# EAGLE design cirquit (EAGLE 8.4.1)
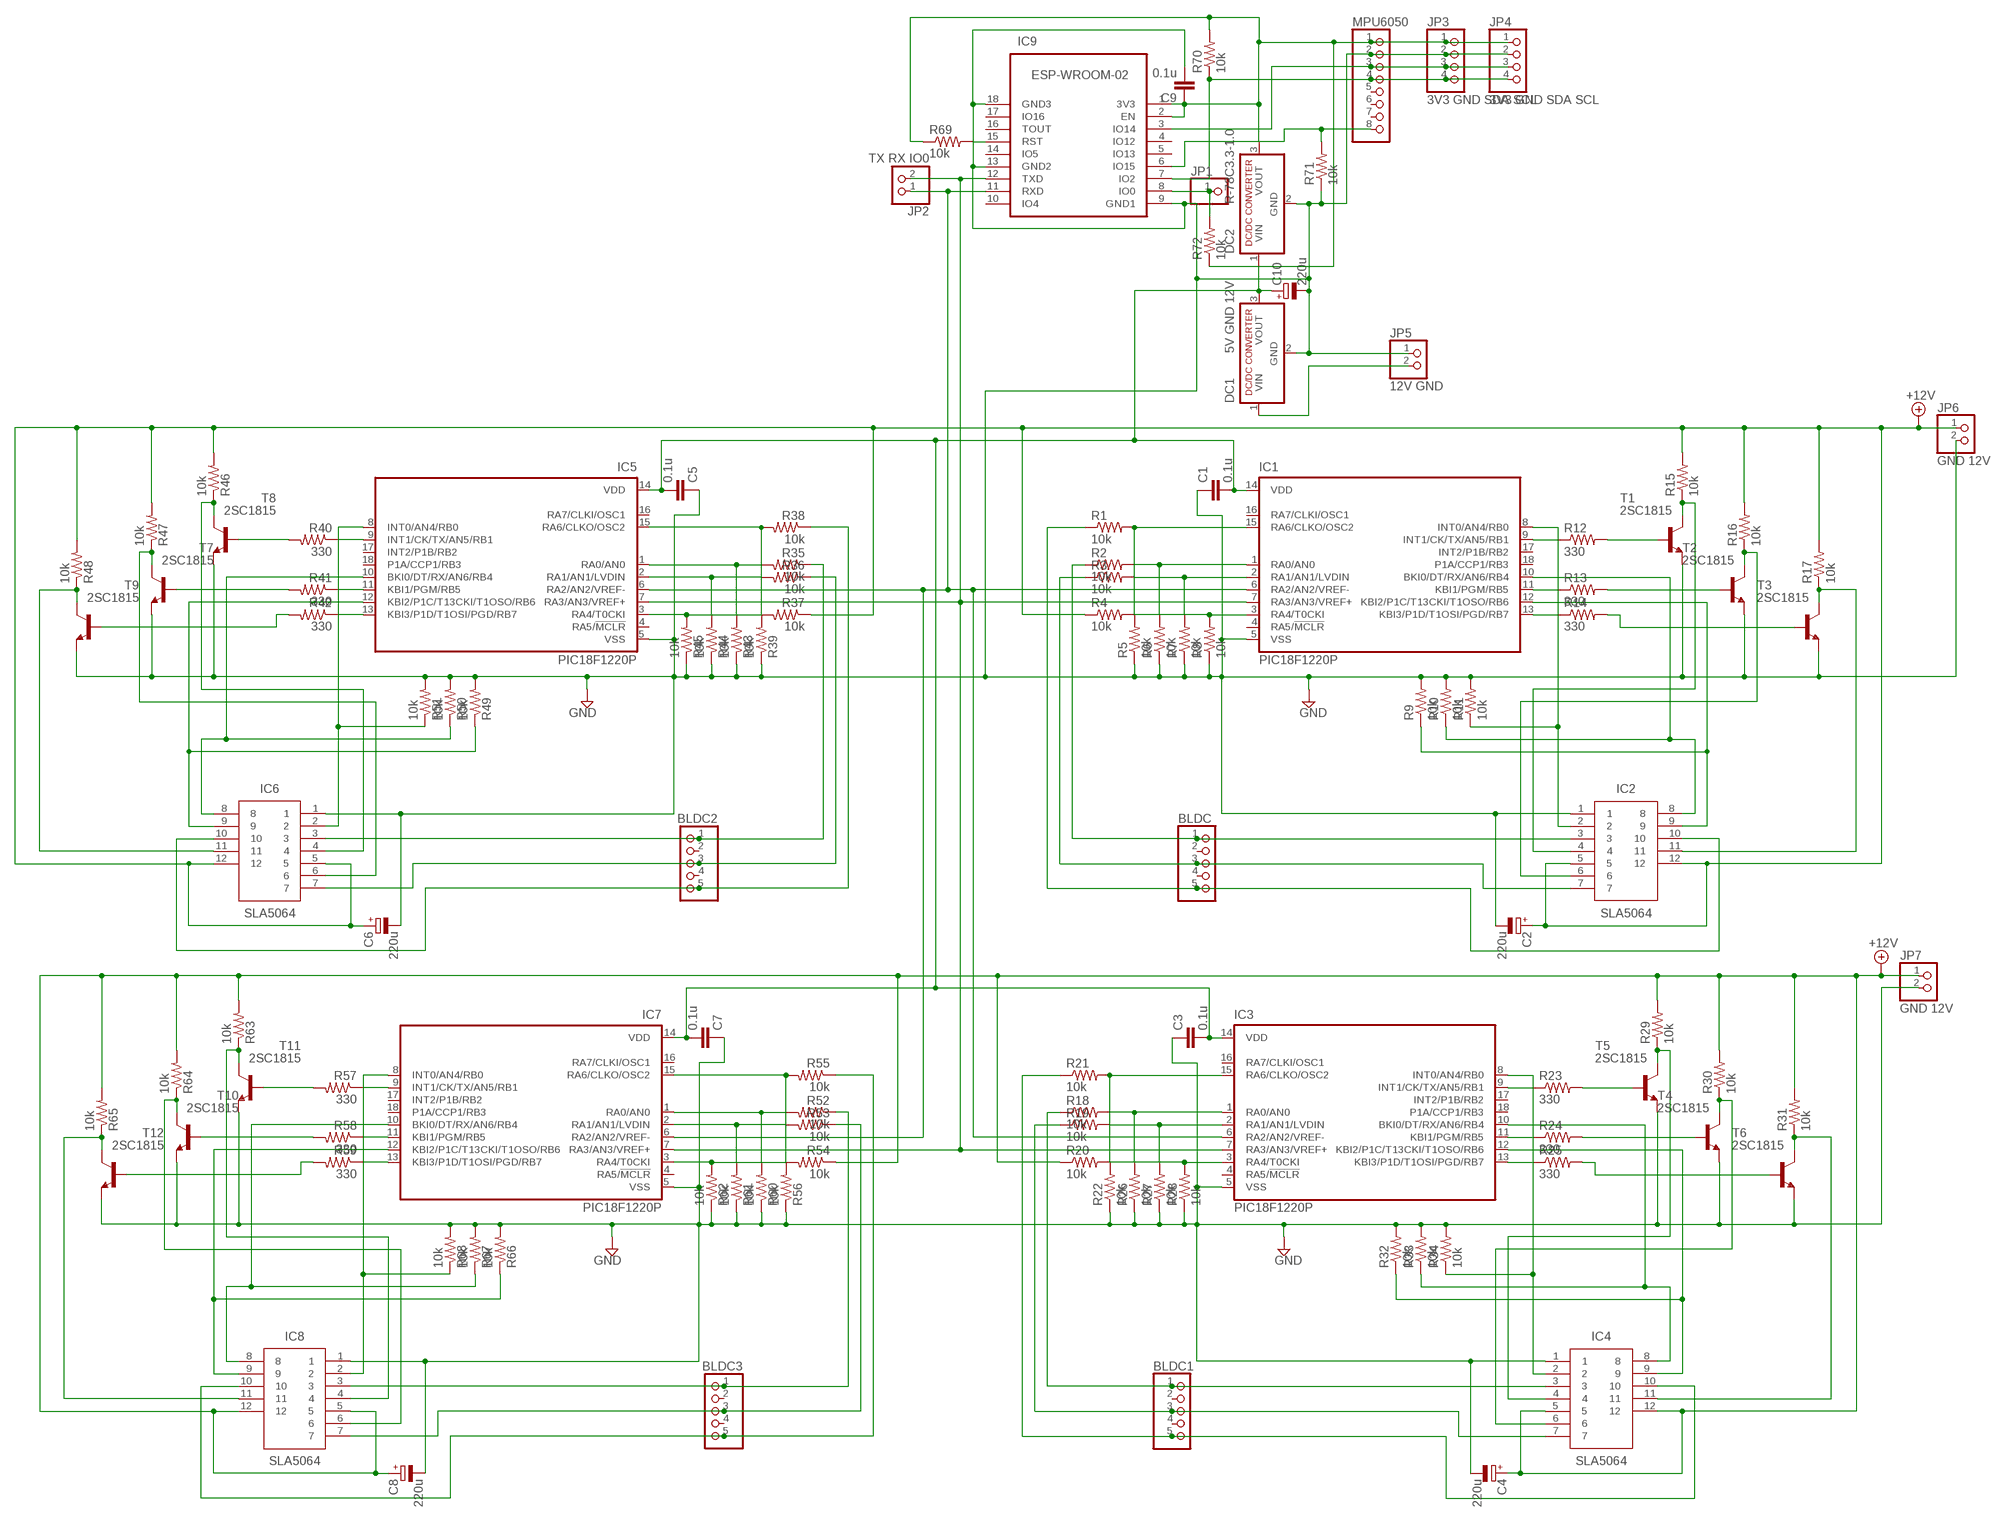
[diagram p0: schematic, sheet 1]

## Parts
BLDC  PINHD-1X5  [1X05]
BLDC1  PINHD-1X5  [1X05]
BLDC2  PINHD-1X5  [1X05]
BLDC3  PINHD-1X5  [1X05]
C1  0.1u  C2.5/2  [C2.5-2]
C2  220u  CPOL-EUE2,5-6E  [E2,5-6E]
C3  0.1u  C2.5/2  [C2.5-2]
C4  220u  CPOL-EUE2,5-6E  [E2,5-6E]
C5  0.1u  C2.5/2  [C2.5-2]
C6  220u  CPOL-EUE2,5-6E  [E2,5-6E]
C7  0.1u  C2.5/2  [C2.5-2]
C8  220u  CPOL-EUE2,5-6E  [E2,5-6E]
C9  0.1u  C2.5/2  [C2.5-2]
C10  220u  CPOL-EUE2,5-6E  [E2,5-6E]
DC1  5V GND 12V  R-78C5.0-1.0  [SIP3]
DC2  R-78C3.3-1.0  [SIP3]
IC1  PIC18F1220P  [DIL18]
IC2  SLA5064  [TO254P500X3150X1890-12P]
IC3  PIC18F1220P  [DIL18]
IC4  SLA5064  [TO254P500X3150X1890-12P]
IC5  PIC18F1220P  [DIL18]
IC6  SLA5064  [TO254P500X3150X1890-12P]
IC7  PIC18F1220P  [DIL18]
IC8  SLA5064  [TO254P500X3150X1890-12P]
IC9  ESP-WROOM-02  ESP-WROOM-02FRONT-FACE  [FRONT-FACE]
JP1  PINHD-1X1  [1X01]
JP2  TX RX IO0  PINHD-1X2  [1X02]
JP3  3V3 GND SDA SCL  PINHD-1X4  [1X04]
JP4  3V3 GND SDA SCL  PINHD-1X4  [1X04]
JP5  12V GND  PINHD-1X2  [1X02]
JP6  GND 12V  PINHD-1X2  [1X02]
JP7  GND 12V  PINHD-1X2  [1X02]
MPU6050  PINHD-1X8  [1X08]
R1  10k  R-US_0204/7  [0204/7]
R2  10k  R-US_0204/7  [0204/7]
R3  10k  R-US_0204/7  [0204/7]
R4  10k  R-US_0204/7  [0204/7]
R5  10k  R-US_0204/7  [0204/7]
R6  10k  R-US_0204/7  [0204/7]
R7  10k  R-US_0204/7  [0204/7]
R8  10k  R-US_0204/7  [0204/7]
R9  10k  R-US_0204/7  [0204/7]
R10  10k  R-US_0204/7  [0204/7]
R11  10k  R-US_0204/7  [0204/7]
R12  330  R-US_0204/7  [0204/7]
R13  330  R-US_0204/7  [0204/7]
R14  330  R-US_0204/7  [0204/7]
R15  10k  R-US_0204/7  [0204/7]
R16  10k  R-US_0204/7  [0204/7]
R17  10k  R-US_0204/7  [0204/7]
R18  10k  R-US_0204/7  [0204/7]
R19  10k  R-US_0204/7  [0204/7]
R20  10k  R-US_0204/7  [0204/7]
R21  10k  R-US_0204/7  [0204/7]
R22  10k  R-US_0204/7  [0204/7]
R23  330  R-US_0204/7  [0204/7]
R24  330  R-US_0204/7  [0204/7]
R25  330  R-US_0204/7  [0204/7]
R26  10k  R-US_0204/7  [0204/7]
R27  10k  R-US_0204/7  [0204/7]
R28  10k  R-US_0204/7  [0204/7]
R29  10k  R-US_0204/7  [0204/7]
R30  10k  R-US_0204/7  [0204/7]
R31  10k  R-US_0204/7  [0204/7]
R32  10k  R-US_0204/7  [0204/7]
R33  10k  R-US_0204/7  [0204/7]
R34  10k  R-US_0204/7  [0204/7]
R35  10k  R-US_0204/7  [0204/7]
R36  10k  R-US_0204/7  [0204/7]
R37  10k  R-US_0204/7  [0204/7]
R38  10k  R-US_0204/7  [0204/7]
R39  10k  R-US_0204/7  [0204/7]
R40  330  R-US_0204/7  [0204/7]
R41  330  R-US_0204/7  [0204/7]
R42  330  R-US_0204/7  [0204/7]
R43  10k  R-US_0204/7  [0204/7]
R44  10k  R-US_0204/7  [0204/7]
R45  10k  R-US_0204/7  [0204/7]
R46  10k  R-US_0204/7  [0204/7]
R47  10k  R-US_0204/7  [0204/7]
R48  10k  R-US_0204/7  [0204/7]
R49  10k  R-US_0204/7  [0204/7]
R50  10k  R-US_0204/7  [0204/7]
R51  10k  R-US_0204/7  [0204/7]
R52  10k  R-US_0204/7  [0204/7]
R53  10k  R-US_0204/7  [0204/7]
R54  10k  R-US_0204/7  [0204/7]
R55  10k  R-US_0204/7  [0204/7]
R56  10k  R-US_0204/7  [0204/7]
R57  330  R-US_0204/7  [0204/7]
R58  330  R-US_0204/7  [0204/7]
R59  330  R-US_0204/7  [0204/7]
R60  10k  R-US_0204/7  [0204/7]
R61  10k  R-US_0204/7  [0204/7]
R62  10k  R-US_0204/7  [0204/7]
R63  10k  R-US_0204/7  [0204/7]
R64  10k  R-US_0204/7  [0204/7]
R65  10k  R-US_0204/7  [0204/7]
R66  10k  R-US_0204/7  [0204/7]
R67  10k  R-US_0204/7  [0204/7]
R68  10k  R-US_0204/7  [0204/7]
R69  10k  R-US_0204/7  [0204/7]
R70  10k  R-US_0204/7  [0204/7]
R71  10k  R-US_0204/7  [0204/7]
R72  10k  R-US_0204/7  [0204/7]
T1  2SC1815  [TO92-ECB]
T2  2SC1815  [TO92-ECB]
T3  2SC1815  [TO92-ECB]
T4  2SC1815  [TO92-ECB]
T5  2SC1815  [TO92-ECB]
T6  2SC1815  [TO92-ECB]
T7  2SC1815  [TO92-ECB]
T8  2SC1815  [TO92-ECB]
T9  2SC1815  [TO92-ECB]
T10  2SC1815  [TO92-ECB]
T11  2SC1815  [TO92-ECB]
T12  2SC1815  [TO92-ECB]

## Nets
+12V [power]: C2.+ C4.+ C6.+ C8.+ IC2.5 IC2.12 IC4.5 IC4.12 IC6.5 IC6.12 IC8.5 IC8.12 JP6.1 JP7.1 R4.1 R15.2 R16.2 R17.2 R20.1 R29.2 R30.2 R31.2 R37.1 R46.2 R47.2 R48.2 R54.1 R63.2 R64.2 R65.2
GND [GND]: C1.1 C2.- C3.1 C4.- C5.1 C6.- C7.1 C8.- C9.2 C10.- DC1.2(GND) DC2.2(GND) IC1.5(VSS) IC2.1 IC3.5(VSS) IC4.1 IC5.5(VSS) IC6.1 IC7.5(VSS) IC8.1 IC9.9(GND1) IC9.13(GND2) IC9.18(GND3) JP3.2 JP4.2 JP5.1 JP6.2 JP7.2 MPU6050.2 R5.1 R6.1 R7.1 R8.1 R9.2 R10.2 R11.2 R22.1 R26.1 R27.1 R28.1 R32.2 R33.2 R34.2 R39.1 R43.1 R44.1 R45.1 R49.2 R50.2 R51.2 R56.1 R60.1 R61.1 R62.1 R66.2 R67.2 R68.2 R71.1 T1.E T2.E T3.E T4.E T5.E T6.E T7.E T8.E T9.E T10.E T11.E T12.E
N$1: IC1.15(RA6/CLKO/OSC2) R1.2 R5.2
N$2: IC1.1(RA0/AN0) R2.2 R6.2
N$3: IC1.2(RA1/AN1/LVDIN) R3.2 R7.2
N$4: IC1.3(RA4/T0CKI) R4.2 R8.2
N$5: IC3.15(RA6/CLKO/OSC2) R21.2 R22.2
N$6 [power]: BLDC.1 IC2.3 R2.1
N$7 [power]: BLDC.3 IC2.7 R3.1
N$8: IC3.1(RA0/AN0) R18.2 R26.2
N$9: IC1.9(INT1/CK/TX/AN5/RB1) R12.1
N$10: IC1.11(KBI1/PGM/RB5) R13.1
N$11: IC1.13(KBI3/P1D/T1OSI/PGD/RB7) R14.1
N$12: R12.2 T1.B
N$13: R13.2 T2.B
N$14: R14.2 T3.B
N$15: IC2.4 R15.1 T1.C
N$16: IC2.6 R16.1 T2.C
N$17: IC2.11 R17.1 T3.C
N$18: IC3.2(RA1/AN1/LVDIN) R19.2 R27.2
N$19: IC3.3(RA4/T0CKI) R20.2 R28.2
N$20 [power]: BLDC1.1 IC4.3 R18.1
N$21 [power]: BLDC1.3 IC4.7 R19.1
N$22: IC1.8(INT0/AN4/RB0) IC2.2 R11.1
N$23: IC1.10(BKI0/DT/RX/AN6/RB4) IC2.8 R10.1
N$24: IC1.12(KBI2/P1C/T13CKI/T1OSO/RB6) IC2.9 R9.1
N$25: IC1.6(RA2/AN2/VREF-) IC3.6(RA2/AN2/VREF-) IC5.6(RA2/AN2/VREF-) IC7.6(RA2/AN2/VREF-) IC9.11(RXD) JP2.1
N$26: C1.2 C3.2 C5.2 C7.2 C10.+ DC1.3(VOUT) DC2.1(VIN) IC1.14(VDD) IC3.14(VDD) IC5.14(VDD) IC7.14(VDD)
N$27: IC3.9(INT1/CK/TX/AN5/RB1) R23.1
N$28: IC3.11(KBI1/PGM/RB5) R24.1
N$29 [power]: BLDC.5 IC2.10 R1.1
N$30: IC3.13(KBI3/P1D/T1OSI/PGD/RB7) R25.1
N$31: R23.2 T5.B
N$32: R24.2 T4.B
N$33: R25.2 T6.B
N$34: IC4.4 R29.1 T5.C
N$35: IC4.6 R30.1 T4.C
N$36: IC4.11 R31.1 T6.C
N$37: IC3.8(INT0/AN4/RB0) IC4.2 R34.1
N$38: IC3.10(BKI0/DT/RX/AN6/RB4) IC4.8 R33.1
N$39: IC3.12(KBI2/P1C/T13CKI/T1OSO/RB6) IC4.9 R32.1
N$40: IC5.15(RA6/CLKO/OSC2) R38.2 R39.2
N$41: C9.1 DC2.3(VOUT) IC9.1(3V3) IC9.2(EN) JP3.1 JP4.1 MPU6050.1 R69.1 R70.2 R72.1
N$42 [power]: BLDC1.5 IC4.10 R21.1
N$43: IC5.1(RA0/AN0) R35.2 R43.2
N$44: IC5.2(RA1/AN1/LVDIN) R36.2 R44.2
N$45: IC5.3(RA4/T0CKI) R37.2 R45.2
N$46 [power]: BLDC2.1 IC6.3 R35.1
N$47 [power]: BLDC2.3 IC6.7 R36.1
N$48: IC5.9(INT1/CK/TX/AN5/RB1) R40.1
N$49: IC5.11(KBI1/PGM/RB5) R41.1
N$50: IC5.13(KBI3/P1D/T1OSI/PGD/RB7) R42.1
N$51: R40.2 T8.B
N$52: R41.2 T7.B
N$53: R42.2 T9.B
N$54: IC6.4 R46.1 T8.C
N$55: IC6.6 R47.1 T7.C
N$56: IC6.11 R48.1 T9.C
N$57: IC5.8(INT0/AN4/RB0) IC6.2 R51.1
N$58: IC5.10(BKI0/DT/RX/AN6/RB4) IC6.8 R50.1
N$59: IC5.12(KBI2/P1C/T13CKI/T1OSO/RB6) IC6.9 R49.1
N$60: IC1.7(RA3/AN3/VREF+) IC3.7(RA3/AN3/VREF+) IC5.7(RA3/AN3/VREF+) IC7.7(RA3/AN3/VREF+) IC9.12(TXD) JP2.2
N$61: DC1.1(VIN) JP5.2
N$62 [power]: BLDC2.5 IC6.10 R38.1
N$63: IC7.15(RA6/CLKO/OSC2) R55.2 R56.2
N$64: IC7.1(RA0/AN0) R52.2 R60.2
N$65: IC7.2(RA1/AN1/LVDIN) R53.2 R61.2
N$66: IC7.3(RA4/T0CKI) R54.2 R62.2
N$67 [power]: BLDC3.1 IC8.3 R52.1
N$68 [power]: BLDC3.3 IC8.7 R53.1
N$69: IC7.9(INT1/CK/TX/AN5/RB1) R57.1
N$70: IC7.11(KBI1/PGM/RB5) R58.1
N$71: IC7.13(KBI3/P1D/T1OSI/PGD/RB7) R59.1
N$72: R57.2 T11.B
N$73: R58.2 T10.B
N$74: R59.2 T12.B
N$75: IC8.4 R63.1 T11.C
N$76: IC8.6 R64.1 T10.C
N$77: IC8.11 R65.1 T12.C
N$78: IC7.8(INT0/AN4/RB0) IC8.2 R68.1
N$79: IC7.10(BKI0/DT/RX/AN6/RB4) IC8.8 R67.1
N$80: IC7.12(KBI2/P1C/T13CKI/T1OSO/RB6) IC8.9 R66.1
N$81: IC9.3(IO14) JP3.3 JP4.3 MPU6050.3
N$82 [power]: BLDC3.5 IC8.10 R55.1
N$83: IC9.7(IO2) JP3.4 JP4.4 MPU6050.4 R70.1
N$84: IC9.6(IO15) MPU6050.8 R71.2
N$86: IC9.15(RST) R69.2
N$89: IC9.8(IO0) JP1.1 R72.2
Unconnected: BLDC1.2 BLDC1.4 BLDC2.2 BLDC2.4 BLDC3.2 BLDC3.4 BLDC.2 BLDC.4 IC1.4(RA5/!MCLR) IC1.16(RA7/CLKI/OSC1) IC1.17(INT2/P1B/RB2) IC1.18(P1A/CCP1/RB3) IC3.4(RA5/!MCLR) IC3.16(RA7/CLKI/OSC1) IC3.17(INT2/P1B/RB2) IC3.18(P1A/CCP1/RB3) IC5.4(RA5/!MCLR) IC5.16(RA7/CLKI/OSC1) IC5.17(INT2/P1B/RB2) IC5.18(P1A/CCP1/RB3) IC7.4(RA5/!MCLR) IC7.16(RA7/CLKI/OSC1) IC7.17(INT2/P1B/RB2) IC7.18(P1A/CCP1/RB3) IC9.4(IO12) IC9.5(IO13) IC9.10(IO4) IC9.14(IO5) IC9.16(TOUT) IC9.17(IO16) MPU6050.5 MPU6050.6 MPU6050.7

## Library data of the parts
BLDC BLDC1-BLDC3 = pinhead:PINHD-1X5: PIN HEADER
C1 C3 C5 C7 C9 = capacitor-wima:C: CAPACITOR naming: grid - package width
C2 C4 C6 C8 C10 = resistor:CPOL-EU: POLARIZED CAPACITOR, European symbol
DC1 DC2 = dc-dc-converter:R-78C*-1.0: INNOLINE DC/DC-Converter 1.0 AMP SIP3 Single Output Source: Data sheet <http://www.mikrocontroller.net/attachment/150645/157764-da-01-en-DC_DC_WANDLER_R_78C5_0_1_0.pdf>
IC1 IC3 IC5 IC7 = microchip:PIC18F1*20: 18/20/28-Pin High-Performance, Enhanced Flash Microcontrollers with 10-bit A/D and nanoWatt Technology Source: ww1.microchip.com/downloads/en/DeviceDoc/39605c.pdf; MF: MICROCHIP; MPN: PIC18F1220-I/P; OC_FARNELL: 9761977; OC_NEWARK: 92C2429
IC2 IC4 IC6 IC8 = SLA5064:SLA5064: N-channel+P-channel 3-phase motor drive <https://componentsearchengine.com/Images/9/SLA5064.jpg> Source: Datasheet <http://akizukidenshi.com/download/ds/sanken/sla5064_ds_jp.pdf>; DESCRIPTION: N-channel+P-channel 3-phase motor drive; HEIGHT: 5mm; MANUFACTURER_NAME: Sanken; MANUFACTURER_PART_NUMBER: SLA5064; SUPPLIER_NAME: RS
IC9 = esp-wroom-02:ESP-WROOM-02: WiFi module - ESP-WROOM-02
JP1 = pinhead:PINHD-1X1: PIN HEADER
JP2 JP5-JP7 = pinhead:PINHD-1X2: PIN HEADER
JP3 JP4 = pinhead:PINHD-1X4: PIN HEADER
MPU6050 = pinhead:PINHD-1X8: PIN HEADER
R1-R72 = resistor:R-US_: RESISTOR, American symbol
T1-T12 = transistor:2SC1815: NPN EPITAXIAL TRANSISTOR Source: TOSHIBA .. 2SC1815 1.pdf

## Net classes
0 default: width 0.178 mm, drill 0.5 mm, clearance 0.152 mm
1 power: width 0.178 mm, drill 0.5 mm, clearance 0.152 mm
2 GND: width 0.178 mm, drill 0.5 mm, clearance 0.152 mm

## Board
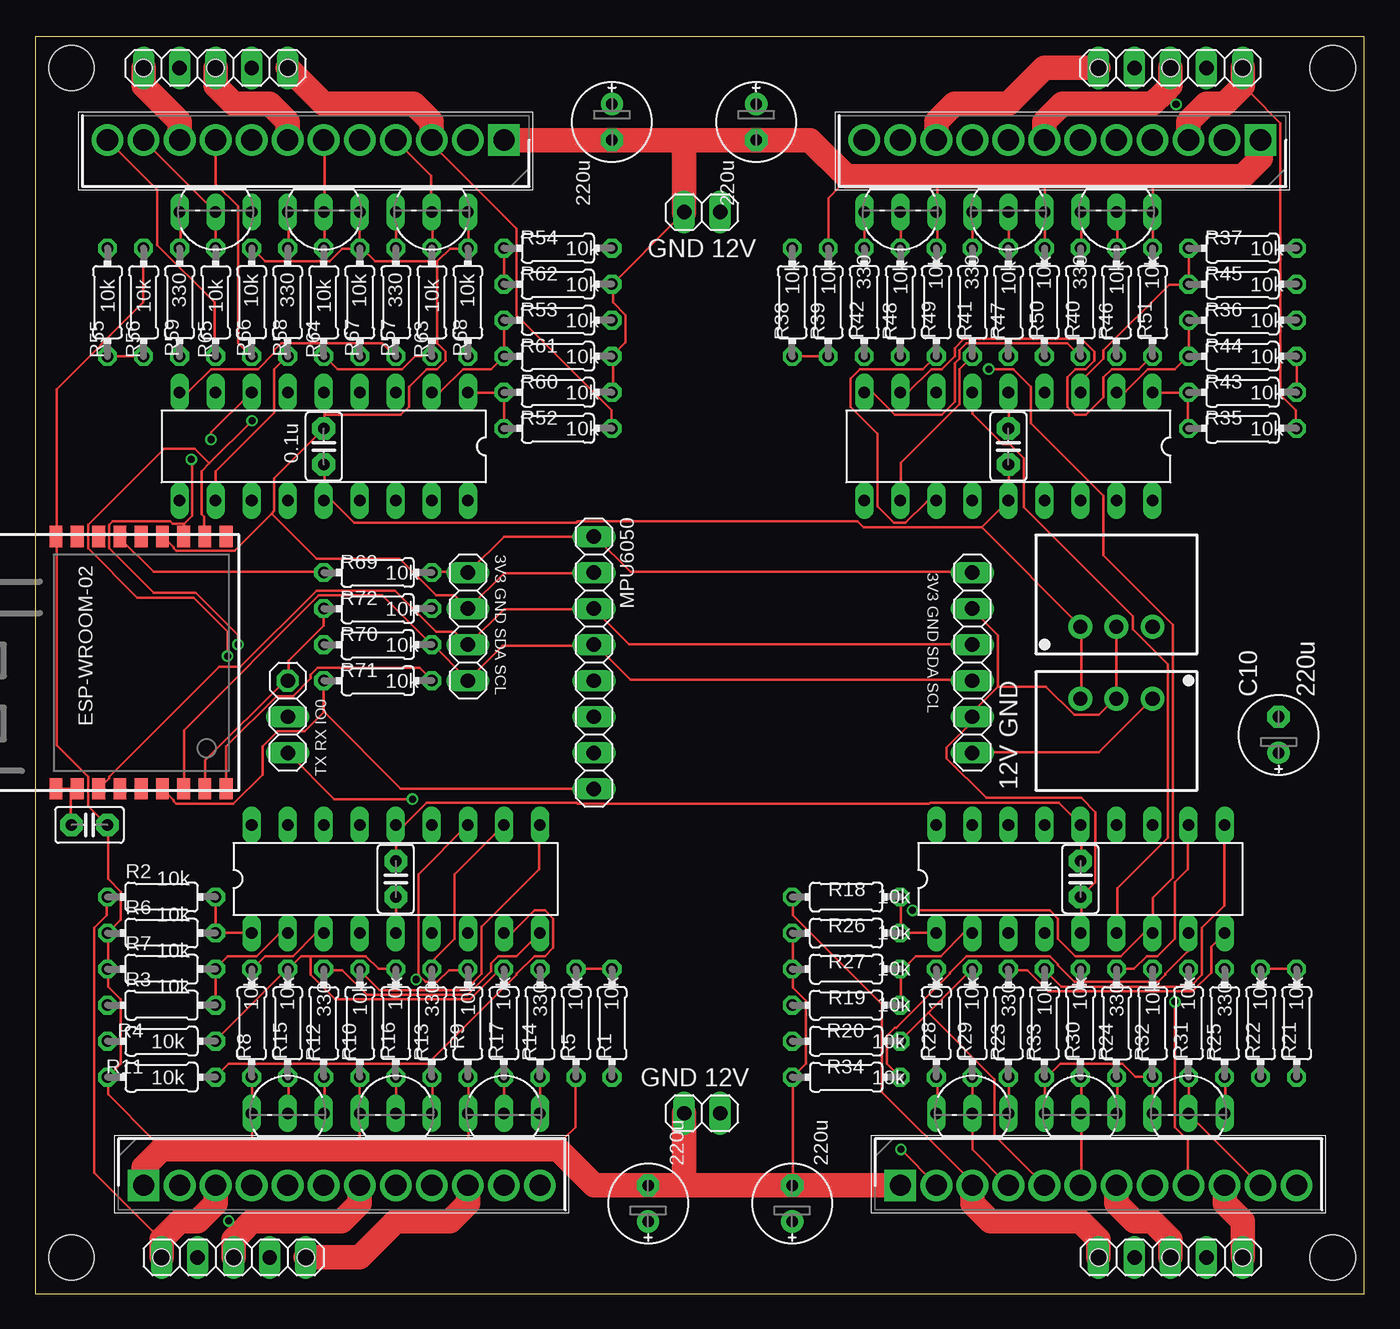
[diagram p1: board, top side]
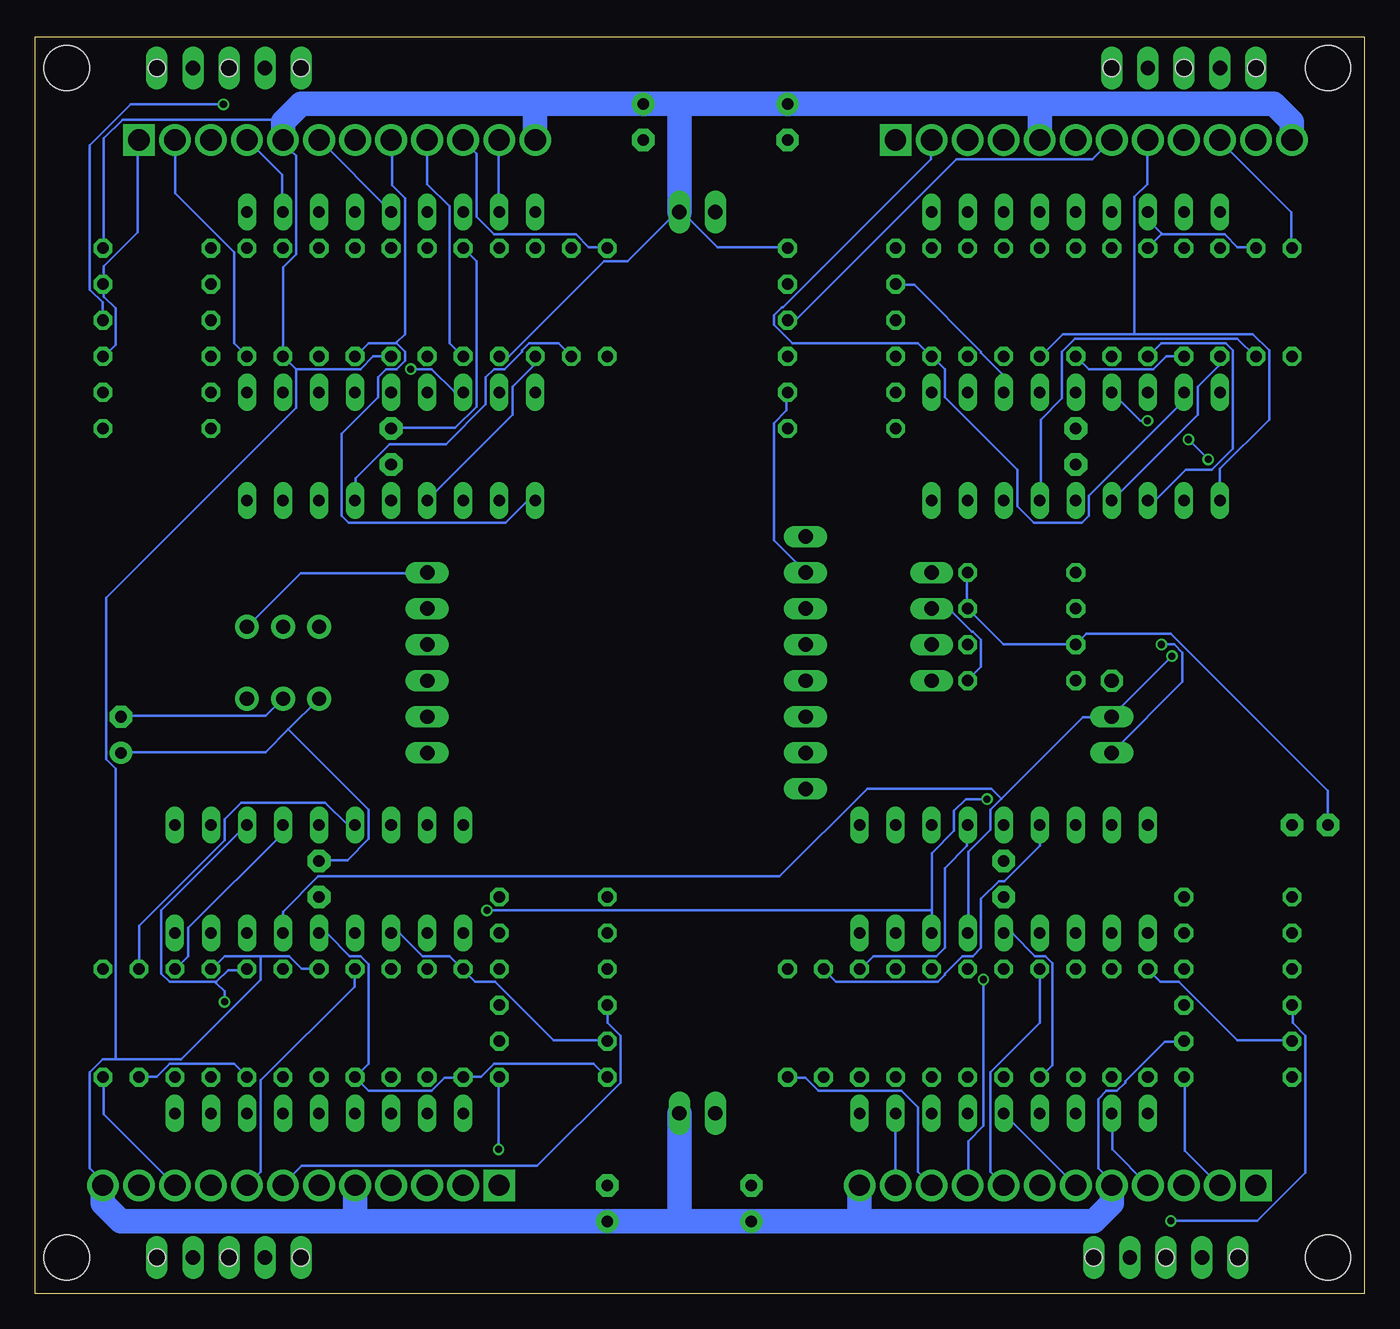
[diagram p2: board, bottom side, seen from below]

Size 93.65 x 88.57 mm. Coordinates in mm from the lower left corner, seen from the top.
Outline: 0,0 93.65,0 93.65,88.57 0,88.57 0,0
Copper layers (1*16): Top 0.035mm / dielectric 1.5mm / Bottom 0.035mm
Design rules "SeeedStudio_2layer_DRU_no_angle_20140221": minimum track width 6mil, minimum drill 12mil, track to track 6mil, track to pad 6mil, pad to pad 6mil, via to via 6mil, smd to smd 0mil, copper to edge 10mil, drill to drill 10mil, minimum pad ring 10mil, minimum via ring 6mil, stop-mask expansion 2mil, vias tented up to drill 100mil, thermal gap 10mil
Holes 3.2 mm at 91.44,2.54 2.54,86.36 2.54,2.54 91.44,86.36
Holes 1.2 mm at 19.05,2.54 8.89,2.54 13.97,2.54 74.93,2.54 80.01,2.54 85.09,2.54 7.62,86.36 12.7,86.36 17.78,86.36 74.93,86.36 80.01,86.36 85.09,86.36

### Footprints (pad centres in the part's own frame; a part is rotated, then mirrored left to right if it is on the bottom)
1X05 = drill 1.016 long: 1 -5.08,0; 2 -2.54,0; 3 0,0; 4 2.54,0; 5 5.08,0
C2.5-2 = drill 0.813 pad 1.6 octagon: 1 -1.27,0; 2 1.27,0
E2,5-6E = drill 0.813 pad 1.575: + -1.27,0 | drill 0.813 pad 1.575 octagon: - 1.27,0
SIP3 = drill 1 pad 1.676: 1 -2.54,0; 2 0,0; 3 2.54,0
DIL18 = drill 0.813 long: 1 -10.16,-3.81; 2 -7.62,-3.81; 3 -5.08,-3.81; 4 -2.54,-3.81; 5 0,-3.81; 6 2.54,-3.81; 7 5.08,-3.81; 8 7.62,-3.81; 9 10.16,-3.81; 10 10.16,3.81; 11 7.62,3.81; 12 5.08,3.81; 13 2.54,3.81; 14 0,3.81; 15 -2.54,3.81; 16 -5.08,3.81; 17 -7.62,3.81; 18 -10.16,3.81
TO254P500X3150X1890-12P = drill 1.49 pad 2.235 square: 1 0,0 | drill 1.49 pad 2.235: 2 2.54,0; 3 5.08,0; 4 7.62,0; 5 10.16,0; 6 12.7,0; 7 15.24,0; 8 17.78,0; 9 20.32,0; 10 22.86,0; 11 25.4,0; 12 27.94,0
FRONT-FACE = smd 1.485 x 0.9: 1 -8.893,4.9; 2 -8.893,3.4; 3 -8.893,1.9; 4 -8.893,0.4; 5 -8.893,-1.1; 6 -8.893,-2.6; 7 -8.893,-4.1; 8 -8.893,-5.6; 9 -8.893,-7.1; 10 8.893,-7.1; 11 8.893,-5.6; 12 8.893,-4.1; 13 8.893,-2.6; 14 8.893,-1.1; 15 8.893,0.4; 16 8.893,1.9; 17 8.893,3.4; 18 8.893,4.9
1X01 = drill 1.016 octagon: 1 0,0
1X02 = drill 1.016 long: 1 -1.27,0; 2 1.27,0
1X04 = drill 1.016 long: 1 -3.81,0; 2 -1.27,0; 3 1.27,0; 4 3.81,0
1X08 = drill 1.016 long: 1 -8.89,0; 2 -6.35,0; 3 -3.81,0; 4 -1.27,0; 5 1.27,0; 6 3.81,0; 7 6.35,0; 8 8.89,0
0204/7 = drill 0.813 octagon: 1 -3.81,0; 2 3.81,0
TO92-ECB = drill 0.813 long: B 2.54,0; C 0,0; E -2.54,0

### Placement (x,y rotation side)
BLDC  13.97,2.54 0 top
BLDC1  80.01,2.54 0 top
BLDC2  80.01,86.36 180 top
BLDC3  12.7,86.36 180 top
C1  68.58,59.69 270 top
C2  50.8,82.55 270 top
C3  20.32,59.69 270 top
C4  53.34,6.35 90 top
C5  25.4,29.21 90 top
C6  40.64,82.55 270 top
C7  73.66,29.21 90 top
C8  43.18,6.35 90 top
C9  3.81,33.02 0 top
C10  87.63,39.37 90 top
DC1  76.2,41.91 180 top
DC2  76.2,46.99 0 top
IC1  25.4,29.21 0 top
IC2  7.62,7.62 0 top
IC3  73.66,29.21 0 top
IC4  60.96,7.62 0 top
IC5  68.58,59.69 180 top
IC6  86.36,81.28 180 top
IC7  20.32,59.69 180 top
IC8  33.02,81.28 180 top
IC9  6.35,44.45 90 top
JP1  17.78,43.18 0 top
JP2  17.78,39.37 270 top
JP3  66.04,46.99 270 top
JP4  30.48,46.99 270 top
JP5  66.04,39.37 270 top
JP6  46.99,76.2 180 top
JP7  46.99,12.7 180 top
MPU6050  39.37,44.45 270 top
R1  40.64,19.05 90 top
R2  8.89,27.94 0 top
R3  8.89,20.32 0 top
R4  8.89,17.78 180 top
R5  38.1,19.05 90 top
R6  8.89,25.4 0 top
R7  8.89,22.86 0 top
R8  15.24,19.05 90 top
R9  30.48,19.05 270 top
R10  22.86,19.05 270 top
R11  8.89,15.24 180 top
R12  20.32,19.05 270 top
R13  27.94,19.05 270 top
R14  35.56,19.05 270 top
R15  17.78,19.05 90 top
R16  25.4,19.05 90 top
R17  33.02,19.05 90 top
R18  57.15,27.94 0 top
R19  57.15,20.32 0 top
R20  57.15,17.78 180 top
R21  88.9,19.05 90 top
R22  86.36,19.05 90 top
R23  68.58,19.05 270 top
R24  76.2,19.05 270 top
R25  83.82,19.05 270 top
R26  57.15,25.4 0 top
R27  57.15,22.86 0 top
R28  63.5,19.05 90 top
R29  66.04,19.05 90 top
R30  73.66,19.05 90 top
R31  81.28,19.05 90 top
R32  78.74,19.05 270 top
R33  71.12,19.05 270 top
R34  57.15,15.24 180 top
R35  85.09,60.96 180 top
R36  85.09,68.58 180 top
R37  85.09,73.66 180 top
R38  53.34,69.85 270 top
R39  55.88,69.85 270 top
R40  73.66,69.85 90 top
R41  66.04,69.85 90 top
R42  58.42,69.85 90 top
R43  85.09,63.5 180 top
R44  85.09,66.04 180 top
R45  85.09,71.12 180 top
R46  76.2,69.85 270 top
R47  68.58,69.85 270 top
R48  60.96,69.85 270 top
R49  63.5,69.85 90 top
R50  71.12,69.85 90 top
R51  78.74,69.85 90 top
R52  36.83,60.96 180 top
R53  36.83,68.58 180 top
R54  36.83,73.66 180 top
R55  5.08,69.85 270 top
R56  7.62,69.85 270 top
R57  25.4,69.85 90 top
R58  17.78,69.85 90 top
R59  10.16,69.85 90 top
R60  36.83,63.5 180 top
R61  36.83,66.04 180 top
R62  36.83,71.12 180 top
R63  27.94,69.85 270 top
R64  20.32,69.85 270 top
R65  12.7,69.85 270 top
R66  15.24,69.85 90 top
R67  22.86,69.85 90 top
R68  30.48,69.85 90 top
R69  24.13,50.8 180 top
R70  24.13,45.72 180 top
R71  24.13,43.18 180 top
R72  24.13,48.26 180 top
T1  17.78,12.7 0 top
T2  25.4,12.7 0 top
T3  33.02,12.7 0 top
T4  73.66,12.7 0 top
T5  66.04,12.7 0 top
T6  81.28,12.7 0 top
T7  68.58,76.2 180 top
T8  76.2,76.2 180 top
T9  60.96,76.2 180 top
T10  20.32,76.2 180 top
T11  27.94,76.2 180 top
T12  12.7,76.2 180 top

### Tracks (layer width: path | path; a pad name or v marks a point on that pad's centre or on a via)
+12V
  Top 0.178: R4.1 12.71,17.83 17.75,22.87 R15.2 17.83,22.87 18.74,23.77 19.4,23.77 | 19.4,23.77 23.28,23.77 24.19,22.87 25.34,22.87 R16.2 | 19.4,23.77 19.4,22.45 21.13,20.72 30.63,20.72 32.69,22.78 33.02,22.78 R17.2 | 62.94,19.77 R29.2 | 62.94,19.77 61,17.83 R20.1 | 62.94,19.77 67.61,15.11 67.61,11.14 71.08,7.68 IC4.5 | R63.2 26.75,66.04 25.84,65.13 21.3,65.13 20.39,66.04 R64.2 | R65.2 12.63,66.04 12.63,69.84 8.59,73.88 8.59,77.76 5.12,81.23 IC8.12
  Bottom 0.178: 77.76,23.77 80.32,23.77 81.23,22.87 R31.2 | 77.76,23.77 75.78,23.77 74.87,22.87 73.72,22.87 R30.2 | C8.+ 43.17,5.12 C8.+ | 53.41,5.08 53.41,5.12 C4.+ | 77.76,23.77 77.76,22.12 83.38,16.51 88,16.51 | 88,16.51 88.91,16.51 89.81,15.6 89.81,8.83 89.32,8.34 IC4.12 | R4.1 12.71,17.75 14.03,17.75 16.84,14.94 16.84,14.86 17.42,14.28 18.16,14.28 18.74,13.7 18.74,8.83 18.24,8.34 IC2.5 | R65.2 13.95,66.04 14.86,65.13 19.4,65.13 20.31,66.04 R64.2 | R47.2 69.84,66.04 70.75,65.13 75.29,65.13 | 75.29,65.13 R46.2 76.19,66.12 76.19,72.31 75.29,73.22 75.29,80.16 75.7,80.57 IC6.5 | R54.1 40.7,73.72 45.57,73.72 47.55,75.7 JP6.1 48.95,75.7 51.92,72.73 53.58,72.73 60.26,66.04 R48.2 | R37.1 88.82,73.72 88.82,81.39 87.5,82.72 77.02,82.72 76.2,82.55 | C6.+ 40.62,83.87 40.62,83.82 | C2.+ 50.77,83.87 50.77,83.82 | 88,16.51 88,36.98 88.66,37.64 88.66,49.03 75.29,62.41 75.29,65.13
  Bottom 1.72: IC4.12 88.9,6.35 87.63,5.08 71.12,5.08 | 71.12,5.08 53.41,5.08 C4.+ 48.26,5.08 | 48.26,5.08 C8.+ 35.56,5.08 | 35.56,5.08 19.05,5.08 17.78,6.35 IC2.5 | IC2.12 35.56,5.08 | JP7.1 48.26,5.08 | IC4.5 71.12,5.08 | IC6.5 76.2,82.55 74.93,83.82 58.42,83.82 | 58.42,83.82 C2.+ 50.77,83.82 48.26,83.82 | 48.26,83.82 C6.+ 40.62,83.82 22.86,83.82 | 22.86,83.82 6.35,83.82 5.08,82.55 IC8.12 | IC8.5 22.86,83.82 | IC6.12 58.42,83.82 | JP6.1 48.26,83.82
GND
  Top 0.178: R43.1 88.91,63.56 R44.1 | R60.1 40.7,63.56 40.7,66.04 R61.1 40.7,66.12 41.6,67.03 41.6,68.93 40.7,69.84 40.7,71.08 R62.1 40.7,71.16 45.16,75.62 JP6.2 | IC5.5 68.6,63.48 68.6,61 C1.1 | R51.2 78.75,73.72 78.75,76.19 T8.E 78.75,76.28 78.75,78.74 | R50.2 71.16,73.72 71.16,76.19 T7.E 71.16,76.28 71.16,78.74 | R49.2 63.56,73.72 63.56,76.19 T9.E 63.56,76.28 63.56,78.74 | R39.1 55.89,73.72 55.89,77.18 56.71,78.01 57.15,78.74 | C6.- 40.62,81.31 40.62,81.28 | C2.- 50.77,81.31 50.77,81.28 | T11.E 30.54,76.19 30.54,73.72 R68.2 30.46,73.64 29.22,73.64 28.32,72.73 | R67.2 22.87,73.72 T10.E | R67.2 22.78,73.64 21.63,73.64 20.72,72.73 16.18,72.73 15.27,73.64 R66.2 | 28.32,72.73 23.94,72.73 22.95,73.72 R67.2 | 16.63,54.94 16.84,55.14 16.84,57.45 20.31,60.92 C3.1 20.39,61 20.39,61.91 | 16.63,54.94 14.03,52.34 9.91,52.34 9.74,52.5 9.74,52.58 9,53.33 IC9.13 | 20.39,61.91 20.39,63.48 IC7.5 | IC9.9 13.46,35.58 13.46,38.55 17,42.1 18.16,42.1 19.4,43.34 19.4,43.59 19.89,44.08 27.08,44.08 27.9,43.26 R71.1 | MPU6050.2 39.29,50.77 33.02,50.77 30.54,48.29 JP4.2 30.46,48.29 29.55,49.2 28.23,49.2 25.67,51.76 19.81,51.76 16.63,54.94 | 28.32,72.73 28.32,66.95 28.89,66.37 28.89,65.71 28.32,65.13 27.57,65.13 26.33,63.89 26.33,62.49 25.76,61.91 20.39,61.91 | 67.86,42.76 66.04,40.95 JP5.1 65.96,40.62 65.96,40.2 64.22,38.47 64.22,37.73 67.03,34.92 73.72,34.92 74.71,33.93 74.71,28.98 73.72,27.98 C7.1 73.72,27.9 73.72,25.43 IC3.5 | 67.86,42.76 67.86,46.39 66.04,48.21 JP3.2 | DC2.2 76.19,46.97 76.19,41.94 DC1.2 76.11,41.94 74.95,40.78 73.22,40.78 71.24,42.76 67.86,42.76 | T6.E 78.75,12.71 78.75,15.19 R32.2 78.67,15.27 77.51,15.27 76.61,16.18 72.23,16.18 71.24,15.19 R33.2 71.16,15.19 71.16,12.71 T4.E
  Top 0.178: T5.E 63.56,12.71 63.56,15.19 R28.1 | IC1.5 25.43,25.43 25.43,27.9 C5.1 | R26.1 53.41,25.34 53.41,22.87 R27.1 53.41,22.78 53.41,21.55 54.32,20.64 54.32,16.18 53.41,15.27 R34.2 53.41,15.19 53.41,7.62 | 15.27,10.16 15.27,12.63 T1.E 15.27,12.71 15.27,15.19 R8.1 | 8.89,10.16 8.34,10.81 5.12,14.03 5.12,15.19 R11.2 5.12,15.27 6.03,16.18 6.03,20.72 5.12,21.63 5.12,22.78 R7.1 5.12,22.87 5.12,25.34 R6.1 5.12,25.43 6.03,26.33 6.03,28.32 5.12,29.22 5.12,32.94 C9.2 5.04,33.02 3.71,34.34 3.71,36.41 1.49,38.63 1.49,53.33 IC9.18 1.49,53.41 1.49,63.73 7.59,69.84 7.59,73.64 R56.1 | 22.87,10.16 22.87,12.63 T2.E 22.87,12.71 22.87,15.19 R10.2 | 30.54,10.16 30.54,12.63 T3.E 30.54,12.71 30.54,15.19 R9.2 | R5.1 38.06,15.19 38.06,11.72 37.23,10.9 36.83,10.16 | C8.- 43.17,7.68 C8.- | C4.- 53.33,7.68 53.33,7.62
  Top 1.72: IC4.1 53.41,7.62 C4.- 53.33,7.62 45.72,7.62 | 45.72,7.62 C8.- 39.37,7.62 36.83,10.16 30.54,10.16 22.87,10.16 15.27,10.16 8.89,10.16 7.62,8.89 IC2.1 | IC8.1 40.62,81.28 C6.- 45.72,81.28 | 45.72,81.28 50.77,81.28 C2.- 54.61,81.28 57.15,78.74 63.56,78.74 71.16,78.74 78.75,78.74 85.09,78.74 86.36,80.01 IC6.1 | JP6.2 45.72,81.28 | JP7.2 45.72,7.62
  Bottom 0.178: R44.1 88.82,66.04 88,66.86 88,69.42 88.82,70.25 88.82,71.08 R45.1 88.82,71.16 88.82,72.4 86.43,74.79 86.43,81.23 IC6.1 | C1.1 68.52,61 64.06,61 62.57,62.49 62.57,72.73 63.48,73.64 R49.2 | 14.28,74.62 9.82,74.62 8.91,73.72 7.68,73.72 R56.1 | 14.28,74.62 15.19,73.72 R66.2 | T12.E 15.19,76.19 15.19,75.62 14.28,74.71 14.28,74.62 | JP4.2 30.46,48.21 29.22,48.21 27.65,46.64 27.57,46.64 26.99,46.06 26.99,44.16 27.9,43.26 R71.1 | R60.1 40.7,63.48 40.7,62.24 41.6,61.34 41.6,53.08 39.38,50.85 MPU6050.2 | C10.- 87.59,40.7 77.43,40.7 76.28,41.85 DC1.2 | R22.1 86.35,15.27 85.11,15.27 84.2,16.18 79.66,16.18 78.75,15.27 R32.2 | IC3.5 73.64,25.34 73.06,25.34 71.49,23.77 70.75,23.77 70.17,23.2 70.17,16.18 71.08,15.27 R33.2 71.08,15.19 70.17,14.28 65.71,14.28 64.8,15.19 63.56,15.19 R28.1 63.48,15.27 62.24,15.27 61.34,16.18 54.32,16.18 53.41,15.27 R34.2 | IC1.5 25.34,25.34 24.77,25.34 23.2,23.77 22.45,23.77 21.96,23.28 21.96,16.1 22.78,15.27 R10.2
N$1
  Top 0.178: R5.2 38.14,22.87 40.62,22.87 R1.2
  Bottom 0.178: IC1.15 22.87,31.53 25.34,29.06 25.76,29.06 26.99,27.82 26.99,24.35 27.57,23.77 28.32,23.77 29.55,22.54 29.55,22.45 30.05,21.96 37.23,21.96 38.06,22.78 R5.2
N$2
  Top 0.178: R2.2 12.71,27.9 12.71,25.43 R6.2 12.79,25.43 15.19,25.43 IC1.1
N$3
  Top 0.178: R3.2 12.71,20.39 12.71,22.78 R7.2 12.71,22.95 13.54,23.77 15.6,23.77 17.17,25.34 17.75,25.34 IC1.2
N$4
  Top 0.178: IC1.3 20.31,25.34 19.73,25.34 18.16,23.77 16.18,23.77 15.27,22.87 R8.2
  Bottom 0.178: R4.2 5.12,17.83 8.91,17.83 13.04,21.96 14.36,21.96 15.19,22.78 R8.2
N$5
  Top 0.178: R22.2 86.43,22.87 88.82,22.87 R21.2
  Bottom 0.178: IC3.15 71.65,33.02 73.22,34.59 79.17,34.59 80.32,33.43 80.32,31.95 86.35,25.92 86.35,22.87 R22.2
N$6
  Top 0.178: R2.1 5.04,27.9 5.04,26.66 4.13,25.76 4.13,8.5 8.26,4.38 8.89,3.81
  Top 1.72: IC2.3 12.7,6.35 11.43,5.08 10.16,5.08 8.89,3.81 BLDC.1
N$7  (via drill 0.5)
  Top 0.178: v13.62,5.12 14.45,4.29
  Top 1.72: IC2.7 22.86,6.35 21.59,5.08 15.24,5.08 14.45,4.29 13.97,3.81 BLDC.3
  Bottom 0.178: v13.62,5.12 7.51,5.12 4.13,8.5 4.13,18.16 5.04,19.07 5.04,20.31 R3.1
N$8
  Top 0.178: R18.2 61,27.9 61,25.43 R26.2 61.09,25.43 63.48,25.43 IC3.1
N$9
  Top 0.178: R12.1 20.39,22.78 21.63,22.78 23.36,21.05 30.46,21.05 32.11,22.7 32.11,23.28 32.61,23.77 33.93,23.77 35.5,25.34 IC1.9
N$10
  Top 0.178: IC1.11 29.55,29.55 29.55,25.01 27.98,23.44 27.98,22.87 R13.1
N$11
  Bottom 0.178: IC1.13 27.98,33.02 27.98,31.53 29.55,29.97 29.55,24.35 30.13,23.77 34.59,23.77 35.5,22.87 R14.1
N$12
  Top 0.178: T1.B 20.39,12.71 20.39,15.19 R12.2
N$13
  Top 0.178: T2.B 27.98,12.71 27.98,15.19 R13.2
N$14
  Top 0.178: T3.B 35.58,12.71 35.58,15.19 R14.2
N$15
  Top 0.178: T1.C 17.83,12.71 17.83,15.19 R15.1
  Bottom 0.178: T1.C 17.75,12.63 17.75,10.15 15.27,7.68 IC2.4
N$16
  Top 0.178: T2.C 25.43,12.71 25.43,15.19 R16.1
  Bottom 0.178: T2.C 25.34,12.63 20.39,7.68 IC2.6
N$17
  Top 0.178: R17.1 T3.C
  Bottom 0.178: IC2.11 T3.C
N$18
  Top 0.178: R19.2 61,20.39 61,22.78 R27.2 61.09,22.78 62.08,23.77 63.81,23.77 65.38,25.34 66.04,25.34 IC3.2
N$19
  Bottom 0.178: R20.2 53.41,17.83 57.12,17.83 61.25,21.96 62.66,21.96 63.48,22.78 R28.2 63.56,22.87 64.47,23.77 66.37,23.77 67.94,25.34 68.52,25.34 IC3.3
N$20
  Top 0.178: R18.1 53.41,27.9 53.41,26.66 59.68,20.39 59.68,14.2 65.55,8.34 IC4.3
  Top 1.72: IC4.3 66.04,6.35 67.31,5.08 73.66,5.08 74.93,3.81 BLDC1.1
N$21
  Top 1.72: IC4.7 76.2,6.35 77.47,5.08 78.74,5.08 80.01,3.81 BLDC1.3
  Bottom 0.178: R19.1 53.33,20.31 53.33,19.07 52.42,18.16 52.42,14.86 58.28,9 74.87,9 76.19,7.68 IC4.7
N$22
  Top 0.178: IC1.8 33.02,25.43 33.6,25.43 35.17,26.99 35.91,26.99 36.49,26.42 36.49,24.35 35.91,23.77 35.17,23.77 33.93,22.54 33.93,22.45 27.65,16.18 13.62,16.18 12.71,15.27 R11.1
  Bottom 0.178: R11.1 12.63,15.19 12.63,10.07 10.24,7.68 IC2.2
N$23
  Top 0.178: IC1.10 35.5,33.02 35.5,29.88 31.45,25.84 31.45,22.54 30.3,21.38 24.27,21.38 22.87,22.78 R10.1
  Bottom 0.178: R10.1 22.87,22.78 22.87,19.07 26.33,15.6 26.33,8.59 25.43,7.68 IC2.8
N$24  (via drill 0.5)
  Top 0.178: 27.08,22.37 26.99,22.45 26.99,29.55 30.46,33.02 IC1.12 | 27.08,22.37 27.49,21.96 28.32,21.96 29.14,22.78 30.46,22.78 R9.1 | 27.08,22.37 v26.83,22.12
  Bottom 0.178: v26.83,22.12 26.83,11.8 27.9,10.73 27.9,7.68 IC2.9
N$25  (via drill 0.5)
  Top 0.178: IC5.6 66.04,61.99 68.19,59.85 68.68,59.85 69.67,58.86 69.67,55.39 77.35,47.71 77.35,46.81 79.83,44.33 79.83,32.11 76.28,28.56 76.28,25.43 IC3.6 | v15.27,61.5 12.26,58.49 | 12.26,58.49 11.72,57.95 11.72,54.9 11.89,54.73 11.89,53.41 IC9.11 | 12.26,58.49 11.23,59.52 9.08,59.52 3.71,54.15 3.71,52.5 7.18,49.03 11.14,49.03 13.54,46.64 v13.54,44.91
  Bottom 0.178: v15.27,61.5 15.77,61.5 17.75,63.48 IC7.6 | 25.55,34.88 19.81,40.62 17.83,40.62 JP2.1 17.75,40.7 v13.54,44.91 | 25.55,34.88 26.33,34.09 26.33,32.69 27.9,31.12 27.9,25.43 IC1.6 | 25.55,34.88 26.25,35.58 35,35.58 41.19,29.39 73.72,29.39 76.19,26.91 76.19,25.43 IC3.6
N$26
  Top 0.178: C5.2 25.43,30.54 25.43,33.02 IC1.14 26,33.02 27.57,34.59 38.14,34.59 38.22,34.51 62.99,34.51 63.07,34.59 72.15,34.59 73.64,33.1 IC3.14 73.72,33.02 73.72,30.54 C7.2 | DC1.3 73.72,41.94 73.72,46.97 DC2.1 73.64,47.05 66.7,53.99 | C3.2 20.39,58.36 20.39,55.89 IC7.14 20.47,55.89 20.89,55.89 22.45,54.32 38.14,54.32 38.22,54.4 57.95,54.4 58.36,53.99 66.7,53.99 | C1.2 68.6,58.36 68.6,55.89 IC5.14 68.52,55.8 66.7,53.99
  Bottom 0.178: DC1.3 75.82,39.75 | 75.82,39.75 77.43,38.14 87.59,38.14 C10.+ | 75.82,39.75 70.17,34.09 70.17,32.03 71.65,30.54 73.64,30.54 C7.2
N$27
  Top 0.178: R23.1 68.6,22.78 69.92,22.78 71.41,21.3 81.56,21.3 82.88,22.62 82.88,24.43 83.79,25.34 IC3.9
N$28
  Top 0.178: R24.1 76.28,22.87 77.43,22.87 78.34,23.77 79.08,23.77 80.32,25.01 80.32,28.98 81.23,29.88 81.23,33.02 IC3.11
N$29
  Top 1.72: IC2.10 30.48,6.35 29.21,5.08 25.4,5.08 22.86,2.54 BLDC.5
  Bottom 0.178: R1.1 40.62,15.19 39.38,15.19 38.47,14.28 32.61,14.28 31.45,13.12 31.45,8.59 30.54,7.68 IC2.10
N$30
  Bottom 0.178: IC3.13 76.28,33.02 76.28,32.36 82.88,25.76 82.88,23.77 83.79,22.87 R25.1
N$31
  Top 0.178: T5.B 68.6,12.71 68.6,15.19 R23.2
N$32
  Top 0.178: T4.B 76.28,12.71 76.28,15.19 R24.2
N$33
  Top 0.178: T6.B 83.87,12.71 83.87,15.19 R25.2
N$34
  Top 0.178: R29.1 T5.C 66.04,10.15 68.52,7.68 IC4.4
N$35
  Top 0.178: R30.1 73.72,15.19 73.72,12.71 T4.C 73.72,12.63 73.72,7.68 IC4.6
N$36
  Top 0.178: R31.1 81.31,15.19 81.31,12.71 T6.C 81.31,12.63 86.35,7.59 IC4.11
N$37  (via drill 0.5)
  Top 0.178: v61,10.15 63.48,7.68 IC4.2 | IC3.8 81.23,25.34 81.23,24.11 79.66,22.54 79.66,22.45 79.17,21.96 73.22,21.96 72.07,23.11 72.07,23.2 71.49,23.77 65.63,23.77 64.47,22.62 64.47,22.54 60.67,18.74 60.59,18.74 60.01,18.16 60.01,16.18 60.92,15.27 R34.1
  Bottom 0.178: v61,10.15 61,15.19 R34.1
N$38
  Top 0.178: IC3.10 83.79,33.02 83.79,27.32 82.22,25.76 82.22,22.45 81.39,21.63 72.31,21.63 71.16,22.78 R33.1
  Bottom 0.178: R33.1 71.16,22.78 71.16,21.63 77.76,15.02 77.76,8.59 78.67,7.68 IC4.8
N$39  (via drill 0.5)
  Top 0.178: v80.32,20.55 80.32,11.72 81.23,10.81 81.23,7.68 IC4.9
  Bottom 0.178: 80.9,21.96 80.07,22.78 78.75,22.78 R32.1 | 80.9,21.96 84.2,21.96 84.78,22.54 84.78,26.99 78.75,33.02 IC3.12 | v80.32,20.55 80.32,21.3 80.9,21.88 80.9,21.96
N$40
  Top 0.178: R39.2 R38.2
  Bottom 0.178: IC5.15 71.08,55.89 71.08,57.45 68.68,59.85 64.72,59.85 61.91,62.66 61.91,64.55 61.34,65.13 60.59,65.13 59.35,66.37 59.35,66.45 58.86,66.95 56.79,66.95 R39.2
N$41
  Top 0.178: R69.1 27.98,50.85 30.46,50.85 JP4.1 30.54,50.85 33.02,53.33 39.29,53.33 MPU6050.1 39.46,53.33 41.94,50.85 66.04,50.85 JP3.1 | 2.48,35.58 2.89,35.58 IC9.2 | 2.48,35.58 1.49,35.58 IC9.1 | 2.48,35.58 2.48,33.02 C9.1
  Bottom 0.178: JP3.1 66.04,50.77 74.95,50.77 78.67,47.05 DC2.3 | C9.1 2.56,33.02 2.56,35.41 13.62,46.48 19.56,46.48 R70.2 20.39,45.73 25.43,45.73 27.9,48.21 R72.1 27.98,48.29 27.98,50.77 R69.1
N$42
  Top 1.72: IC4.10 83.82,6.35 85.09,5.08 BLDC1.5
  Bottom 0.178: R21.1 88.82,15.19 88.82,12.63 83.87,7.68 IC4.10
N$43
  Top 0.178: IC5.1 78.75,63.48 81.23,63.48 R43.2 81.23,63.4 81.23,61 R35.2
N$44
  Top 0.178: IC5.2 76.28,63.56 76.85,63.56 78.42,65.13 80.32,65.13 81.23,66.04 R44.2 81.31,66.12 81.31,68.52 R36.2
N$45
  Top 0.178: IC5.3 73.72,63.56 73.72,64.31 75.29,65.88 75.29,66.45 79.91,71.08 81.23,71.08 R45.2 81.31,71.16 81.31,73.64 R37.2
N$46
  Top 0.178: R35.1 88.82,61 88.82,62.24 87.75,63.32 87.75,82.47 85.69,84.53 85.09,85.09
  Top 1.72: IC6.3 81.28,82.55 82.55,83.82 83.82,83.82 85.09,85.09 BLDC2.1
N$47  (via drill 0.5)
  Top 0.178: v80.4,83.79 79.56,84.64
  Top 1.72: IC6.7 71.12,82.55 72.39,83.82 78.74,83.82 79.56,84.64 80.01,85.09 BLDC2.3
  Bottom 0.178: v80.4,83.79 86.92,83.79 89.81,80.9 89.81,70.75 88.91,69.84 88.91,68.6 R36.1
N$48
  Top 0.178: IC5.9 58.45,63.48 59.02,63.48 60.59,61.91 63.89,61.91 64.8,62.82 64.8,65.55 65.13,65.88 65.13,66.45 65.63,66.95 72.73,66.95 73.64,66.04 R40.1
N$49
  Top 0.178: R41.1 65.13,65.13 65.13,62.66 61,58.53 61,55.89 IC5.11
N$50
  Bottom 0.178: R42.1 58.45,66.04 58.45,65.46 60.01,63.89 60.01,61.91 IC5.13
N$51
  Top 0.178: R40.2 73.72,73.72 73.72,76.19 T8.B
N$52
  Top 0.178: T7.B R41.2
N$53
  Top 0.178: R42.2 58.45,73.72 58.45,76.19 T9.B
N$54
  Top 0.178: R46.1 76.28,73.72 76.28,76.19 T8.C
  Bottom 0.178: T8.C 76.28,76.28 76.28,78.83 78.67,81.23 IC6.4
N$55
  Top 0.178: R47.1 68.6,73.72 68.6,76.19 T7.C
  Bottom 0.178: T7.C 68.6,76.28 73.64,81.31 IC6.6
N$56
  Top 0.178: R48.1 61,73.72 61,76.19 T9.C
  Bottom 0.178: T9.C 61,76.28 61,81.23 IC6.11
N$57
  Top 0.178: IC5.8 61,63.56 61.58,63.56 63.15,65.13 63.89,65.13 64.8,66.04 64.8,66.62 65.46,67.28 73.72,67.28 74.62,66.37 74.62,65.71 74.05,65.13 73.3,65.13 72.73,64.55 72.73,62.49 73.3,61.91 74.05,61.91 75.29,63.15 75.29,64.55 75.86,65.13 77.76,65.13 78.67,66.04 R51.1
  Bottom 0.178: IC6.2 83.79,81.23 83.79,77.51 79.66,73.39 79.66,66.95 78.75,66.04 R51.1
N$58
  Bottom 0.178: 68.19,66.95 67.61,66.37 67.61,65.71 68.19,65.13 68.93,65.13 69.51,64.55 69.51,63.15 72.07,60.59 72.07,54.81 71.57,54.32 60.51,54.32 59.02,55.8 58.45,55.8 IC5.10 | 68.19,66.95 70.17,66.95 71.08,66.04 R50.1 | IC6.8 68.52,81.23 68.52,78.09 67.61,77.18 67.61,67.61 68.19,67.03 68.19,66.95
N$59
  Top 0.178: IC5.12 63.48,55.8 62.82,55.8 61.34,54.32 60.51,54.32 59.35,55.47 59.35,60.59 57.45,62.49 57.45,64.47 58.12,65.13 62.57,65.13 63.48,66.04 R49.1
  Bottom 0.178: IC6.9 66.04,78.17 64.47,76.61 64.47,66.95 63.56,66.04 R49.1
N$60  (via drill 0.5)
  Top 0.178: 10.48,54.23 10.48,53.41 IC9.12 | 10.48,54.23 11.06,54.81 11.06,58.69 v10.98,58.78 | v12.38,60.18 12.38,60.67 15.19,63.48 IC7.7 | v26.58,34.84 21.05,34.84 17.83,38.06 JP2.2 | v61.83,26.99 71.49,26.99 72.07,26.42 72.07,25.01 73.3,23.77 76.52,23.77 78.09,25.34 78.67,25.34 IC3.7 78.75,25.43 78.75,27.9 80.16,29.3 80.16,47.14 75.29,52.01 75.29,56.22 70.17,61.34 70.17,63.89 68.93,65.13 v67.2,65.13 | 10.48,54.23 9.66,54.23 9.49,54.4 5.45,54.4 5.2,54.15 5.2,52.5 8.34,49.37 11.31,49.37 14.28,46.39 v14.28,45.73
  Bottom 0.178: v12.38,60.18 v10.98,58.78 | 30.46,26.99 30.46,31.04 28.89,32.61 28.89,34.01 28.07,34.84 v26.58,34.84 | 30.46,26.99 30.46,25.43 IC1.7 | 30.46,26.99 v61.83,26.99 | v67.2,65.13 65.71,65.13 64.14,63.56 63.56,63.56 IC5.7 | v14.28,45.73 13.37,45.73 12.79,45.16 12.79,43.09 17.75,38.14 JP2.2
N$61
  Top 0.178: JP5.2 66.04,38.14 74.95,38.14 78.67,41.85 DC1.1
N$62
  Top 1.72: IC6.10 63.5,82.55 64.77,83.82 68.58,83.82 71.12,86.36 BLDC2.5
  Bottom 0.178: R38.1 53.41,73.72 54.65,73.72 55.56,74.62 61.34,74.62 62.57,75.86 62.57,80.32 63.48,81.23 IC6.10
N$63
  Top 0.178: R56.2 R55.2
  Bottom 0.178: IC7.15 22.78,55.89 22.78,61.58 21.3,63.07 21.3,66.37 20.39,67.28 8.91,67.28 7.68,66.04 R56.2
N$64
  Top 0.178: IC7.1 30.54,63.48 33.02,63.48 R60.2 R52.2
N$65
  Top 0.178: IC7.2 27.98,63.56 28.56,63.56 30.13,65.13 32.11,65.13 R61.2 R53.2
N$66
  Top 0.178: R62.2 R54.2
  Bottom 0.178: IC7.3 25.43,63.56 25.43,64.72 26.99,66.29 26.99,66.37 31.7,71.08 33.02,71.08 R62.2
N$67
  Top 0.178: R52.1 40.62,61 40.62,62.24 33.93,68.93 33.93,75.04 28.4,80.57 IC8.3
  Top 1.72: IC8.3 27.94,82.55 26.67,83.82 20.32,83.82 BLDC3.1
N$68
  Top 1.72: IC8.7 17.78,82.55 16.51,83.82 13.97,83.82 12.7,85.09 BLDC3.3
  Bottom 0.178: IC8.7 19.15,79.91 28.73,79.91 40.04,68.6 40.62,68.6 R53.1
N$69
  Top 0.178: IC7.9 10.24,63.56 10.81,63.56 12.38,65.13 15.68,65.13 16.84,66.29 16.84,66.45 17.34,66.95 24.43,66.95 25.34,66.04 R57.1
N$70
  Top 0.178: IC7.11 12.71,55.89 12.71,57.95 16.84,62.08 16.84,65.13 17.75,66.04 R58.1
N$71
  Bottom 0.178: R59.1 10.24,66.04 10.24,65.38 11.72,63.89 11.72,61.91 17.75,55.89 IC7.13
N$72
  Top 0.178: R57.2 25.43,73.72 25.43,76.19 T11.B
N$73
  Top 0.178: R58.2 17.83,73.72 17.83,76.19 T10.B
N$74
  Top 0.178: R59.2 10.24,73.72 10.24,76.19 T12.B
N$75
  Top 0.178: R63.1 27.98,73.72 27.98,76.19 T11.C 27.9,76.28 27.9,78.75 25.43,81.23 IC8.4
N$76
  Top 0.178: R64.1 20.39,73.72 20.39,76.19 T10.C 20.39,76.28 20.39,81.23 IC8.6
N$77
  Top 0.178: R65.1 12.71,73.72 12.71,76.19 T12.C 12.63,76.28 7.68,81.23 IC8.11
N$78
  Bottom 0.178: IC7.8 12.71,63.48 12.71,62.9 19.4,56.22 19.4,54.81 19.89,54.32 23.28,54.32 24.43,55.47 24.43,58.03 29.55,63.15 29.55,65.13 30.46,66.04 R68.1 30.54,66.04 31.45,66.95 40.28,66.95 41.6,68.27 41.6,68.93 41.03,69.51 40.95,69.51 30.54,79.91 30.54,81.23 IC8.2
N$79
  Bottom 0.178: 16.18,67.61 21.21,67.61 22.78,66.04 R67.1 | 16.18,67.61 7.84,67.61 6.69,66.45 6.69,61.58 10.15,58.12 IC7.10 | 16.18,67.61 16.18,77.27 15.27,78.17 15.27,81.23 IC8.8
N$80
  Top 0.178: IC8.9 12.71,81.23 12.71,78.17 14.28,76.61 14.28,66.95 15.19,66.04 R66.1
  Bottom 0.178: IC7.12 15.19,55.89 14.69,55.89 12.55,58.03 10.73,58.03 9.25,59.52 9.25,66.45 9.74,66.95 14.28,66.95 15.19,66.04 R66.1
N$81
  Top 0.178: IC9.3 4.46,35.58 5.2,36.32 5.2,36.41 12.96,44.16 14.45,44.16 19.81,49.53 25.34,49.53 28.23,46.64 29.55,46.64 30.46,45.73 JP4.3 30.54,45.73 33.02,48.21 39.29,48.21 MPU6050.3 39.38,48.21 41.85,45.73 66.04,45.73 JP3.3
N$82
  Top 1.72: IC8.10 10.16,82.55 7.62,85.09 BLDC3.5
  Bottom 0.178: R55.1 5.12,73.72 5.12,76.19 10.15,81.23 IC8.10
N$83
  Top 0.178: IC9.7 10.48,35.58 10.48,39.71 19.98,49.2 24.43,49.2 27.9,45.73 R70.1 27.98,45.73 30.46,43.26 JP4.4 30.54,43.26 32.94,45.65 39.29,45.65 MPU6050.4 39.46,45.73 41.94,43.26 66.04,43.26 JP3.4
N$84
  Top 0.178: 20.31,40.95 18.99,39.62 17.09,39.62 16.02,38.55 16.02,36.57 13.95,34.51 9.91,34.51 9.74,34.67 9.74,34.75 9,35.5 IC9.6 | 20.31,40.95 20.31,43.17 R71.2 | MPU6050.8 39.29,35.58 25.76,35.58 20.39,40.95 20.31,40.95
N$86
  Top 0.178: IC9.15 6.03,53.33 6.03,53.16 8.34,50.85 20.31,50.85 R69.2
N$89
  Top 0.178: IC9.8 11.97,35.58 11.97,37.56 17.58,43.17 17.75,43.17 JP1.1 17.83,43.26 17.83,44.58 20.31,47.05 20.31,48.21 R72.2